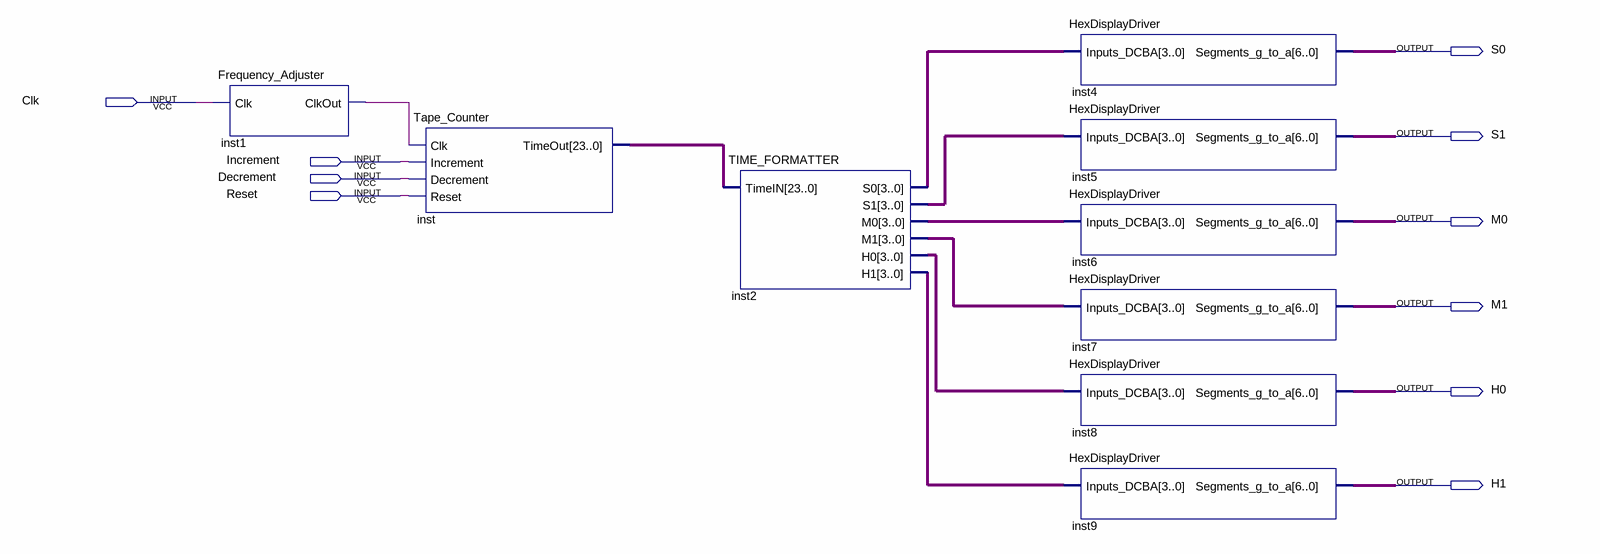
[diagram p0: schematic sheet]
// Quartus schematic VCR.bdf as structural Verilog: 9 symbols, 10 pins
module VCR (
  input  Clk,
  input  Increment,
  input  Decrement,
  input  Reset,
  output S0,
  output S1,
  output M0,
  output M1,
  output H0,
  output H1
);

  wire inst1_clkout;
  wire [3:0] inst2_h0, inst2_h1, inst2_m0, inst2_m1, inst2_s0, inst2_s1;
  wire [6:0] inst4_segments_g_to_a, inst5_segments_g_to_a, inst6_segments_g_to_a, inst7_segments_g_to_a,
       inst8_segments_g_to_a, inst9_segments_g_to_a;
  wire [23:0] inst_timeout;

  Frequency_Adjuster inst1 (.Clk(Clk), .ClkOut(inst1_clkout));
  Tape_Counter inst (
    .Clk(inst1_clkout), .Increment(Increment), .Decrement(Decrement), .Reset(Reset), .TimeOut(inst_timeout));
  TIME_FORMATTER inst2 (
    .TimeIN(inst_timeout), .S0(inst2_s0), .S1(inst2_s1), .M0(inst2_m0), .M1(inst2_m1), .H0(inst2_h0),
    .H1(inst2_h1));
  HexDisplayDriver inst4 (.Inputs_DCBA(inst2_s0), .Segments_g_to_a(inst4_segments_g_to_a));
  HexDisplayDriver inst5 (.Inputs_DCBA(inst2_s1), .Segments_g_to_a(inst5_segments_g_to_a));
  HexDisplayDriver inst6 (.Inputs_DCBA(inst2_m0), .Segments_g_to_a(inst6_segments_g_to_a));
  HexDisplayDriver inst7 (.Inputs_DCBA(inst2_m1), .Segments_g_to_a(inst7_segments_g_to_a));
  HexDisplayDriver inst8 (.Inputs_DCBA(inst2_h0), .Segments_g_to_a(inst8_segments_g_to_a));
  HexDisplayDriver inst9 (.Inputs_DCBA(inst2_h1), .Segments_g_to_a(inst9_segments_g_to_a));
endmodule
